# Altium schematic sheet Glucometer-InstrumentationCircuit-SMD.SchDoc
size A4; PageSetup: Record=PageOptions|CenterHorizontal=True|CenterVertical=True|PrintScale=1.00|XCorrection=1.00|YCorrection=1.00|PrintKind=1|BorderSize=5000000|LeftOffset=0|BottomOffset=0|Orientation=1|PaperLength=1000|PaperWidth=1000|Scale=100|PaperSource=7|PrintQuality=-4|MediaType=1|DitherType=10|PaperKind=A4|PrintScaleMode=1
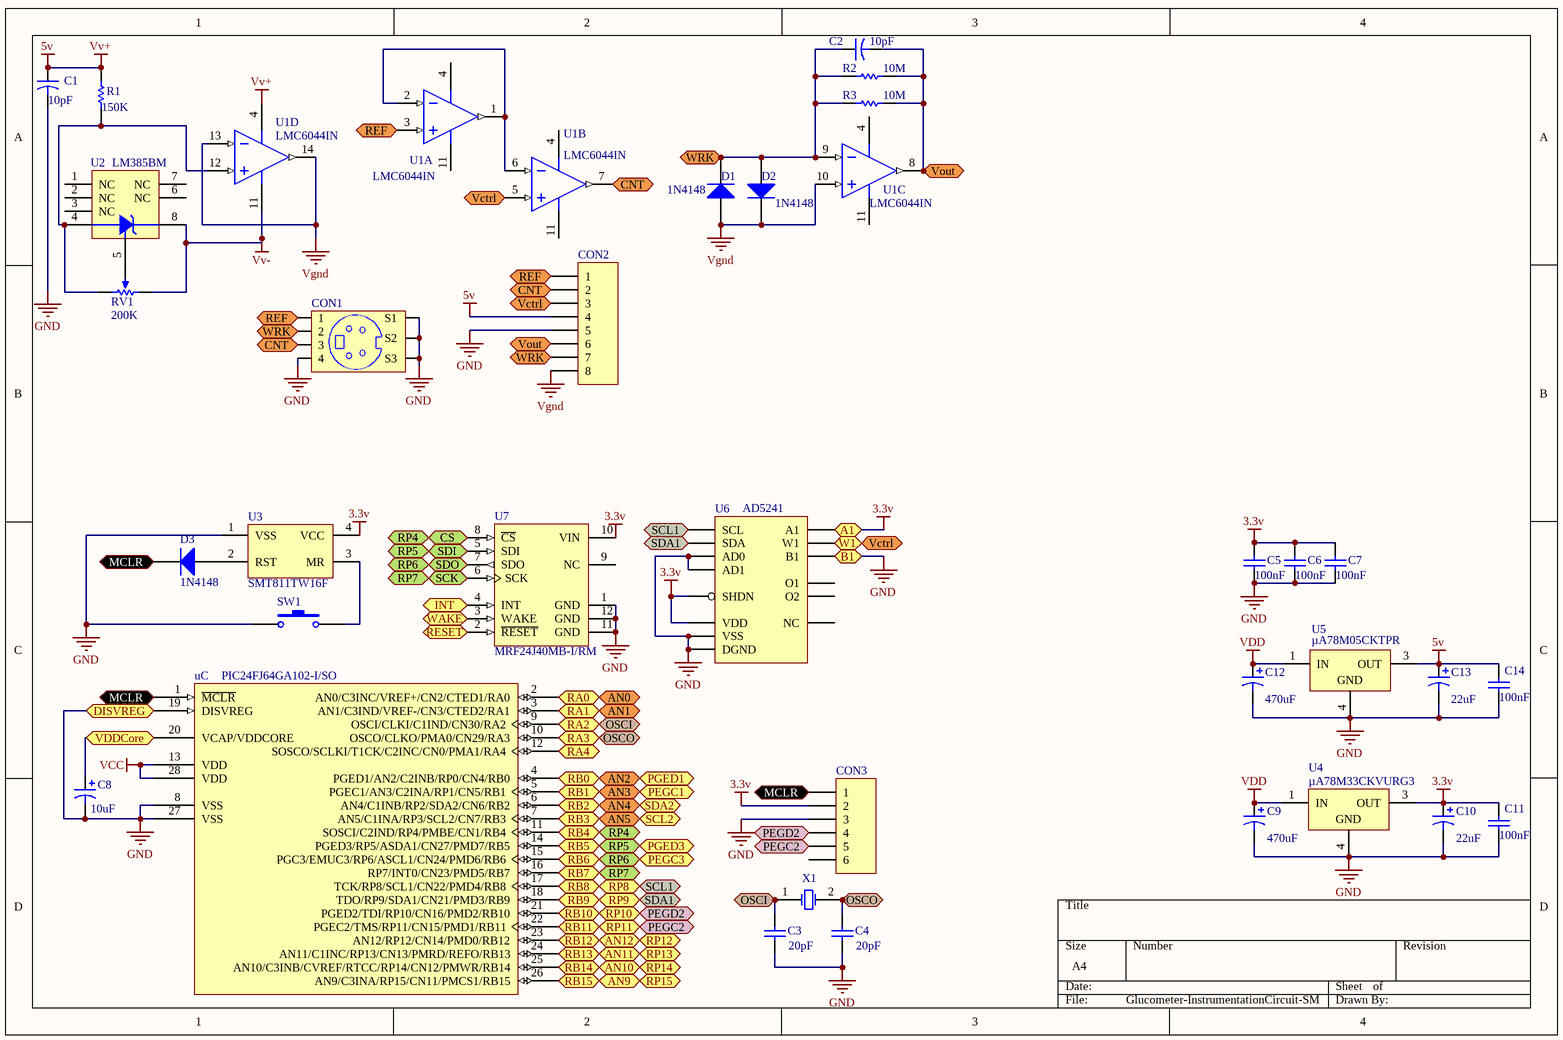
[diagram p0: Glucometer-InstrumentationCircuit-SMD.SchDoc]

## Parts
C1  value 10pF  [CAPC4532N]  (hidden comment: Cap2)
C2  value 10pF  [CAPC1005M]  (hidden comment: Cap2)
C3  value 20pF  [CAPR5-4X5]  (hidden comment: Cap)
C4  value 20pF  [CAPR5-4X5]  (hidden comment: Cap)
C5  value 100nF  [CAPC4532N]  (hidden comment: Cap)
C6  value 100nF  [CAPC4532N]  (hidden comment: Cap)
C7  value 100nF  [CAPC4532N]  (hidden comment: Cap)
C8  value 10uF  [C-4x4]  (hidden comment: Cap Pol1)
C9  value 470uF  [C-10x10]  (hidden comment: Cap Pol1)
C10  value 22uF  [C-4x4]  (hidden comment: Cap Pol1)
C11  value 100nF  [CAPC4532N]  (hidden comment: Cap)
C12  value 470uF  [C-10x10]  (hidden comment: Cap Pol1)
C13  value 22uF  [C-4x4]  (hidden comment: Cap Pol1)
C14  value 100nF  [CAPC4532N]  (hidden comment: Cap)
CON1  (no value)  [CDIN2.6-3H4A]
CON2  Header 8  [HDR1X8]  (value not drawn)
CON3  Header 6  [HDR1X6]  (value not drawn)
D1  1N4148  [DO-35]
D2  1N4148  [DO-35]
D3  1N4148  [DO-35]
R1  value 150K  [RESC5025N]  (hidden comment: Res1)
R2  value 10M  [RESC5025N]  (hidden comment: Res1)
R3  value 10M  [RESC5025N]  (hidden comment: Res1)
RV1  value 200K  [VR5]  (hidden comment: RPot)
SW1  SW-PB  [SPST-2]  (value not drawn)
U1  LMC6044IN  [M14A_N]  (parts A,B,C,D of 4)
U2  LM385BM  [M08A_N]
U3  SMT811TW16F  [SOT143]
U4  µA78M33CKVURG3  [KTP02]
U5  µA78M05CKTPR  [KTP02]
U6  AD5241  [R-14_N]
U7  MRF24J40MB-I/RM  [MRF24J40MB]
uC  PIC24FJ64GA102-I/SO  [SOIC-SO28_N]
X1  XTAL  [R38]  (value not drawn)

## Ports
A1, AN0, AN1, AN2, AN3, AN4, AN5, AN9, AN10, AN11, AN12, B1, CNT, CS, DISVREG, INT, MCLR, OSCI, OSCO, PEGC1, PEGC2, PEGC3, PEGD2, PGED1, PGED3, RA0, RA1, RA2, RA3, RA4, RB0, RB1, RB2, RB3, RB4, RB5, RB6, RB7, RB8, RB9, RB10, RB11, RB12, RB13, RB14, RB15, REF, RESET, RP4, RP5, RP6, RP7, RP8, RP9, RP10, RP11, RP12, RP13, RP14, RP15, SCK, SCL1, SCL2, SDA1, SDA2, SDI, SDO, Vctrl, VDDCore, Vout, W1, WAKE, WRK

## Nets
3.3v: C5.2 C6.2 C7.2 C10.1 C11.2 CON3.2 U3.4(VCC) U4.3(OUT) U6.1(A1) U6.4(VDD) U6.5(SHDN) U7.10(VIN) ; port A1
5v: C1.1 C13.1 C14.2 CON2.4 R1.2 U1.4(V+) U5.3(OUT)  [also labelled Vv+]
GND: C1.2 C3.1 C4.1 C5.1 C6.1 C7.1 C8.2 C9.2 C10.2 C11.1 C12.2 C13.2 C14.1 CON1.4 CON1.MH1(S1) CON1.MH2(S2) CON1.MH3(S3) CON2.5 CON3.3 SW1.1 U3.1(VSS) U4.4(GND) U5.4(GND) U6.3(B1) U6.8(AD0) U6.9(AD1) U6.10(DGND) U6.11(VSS) U7.1(GND) U7.11(GND) U7.12(GND) uC.8(VSS) uC.19(DISVREG) uC.27(VSS) ; port DISVREG, port B1
VCC: uC.13(VDD) uC.28(VDD)
VDD: C9.1 C12.1 U4.1(IN) U5.1(IN)
Vgnd: CON2.8 D1.1(A) D2.2(K) U1.10(IN3+) U1.13(IN4-) U1.14(OUT4)
Vv-: RV1.1(TOP) U1.11(V-) U2.8(+V)
AN0: uC.2(AN0/C3INC/VREF+/CN2/CTED1/RA0) ; port RA0, port AN0
AN1: uC.3(AN1/C3IND/VREF-/CN3/CTED2/RA1) ; port RA1, port AN1
AN2: uC.4(PGED1/AN2/C2INB/RP0/CN4/RB0) ; port RB0, port AN2, port PGED1
AN3: uC.5(PGEC1/AN3/C2INA/RP1/CN5/RB1) ; port RB1, port AN3, port PEGC1
AN4: uC.6(AN4/C1INB/RP2/SDA2/CN6/RB2) ; port RB2, port AN4, port SDA2
AN5: uC.7(AN5/C1INA/RP3/SCL2/CN7/RB3) ; port RB3, port AN5, port SCL2
AN9: uC.26(AN9/C3INA/RP15/CN11/PMCS1/RB15) ; port RB15, port AN9, port RP15
AN10: uC.25(AN10/C3INB/CVREF/RTCC/RP14/CN12/PMWR/RB14) ; port RB14, port AN10, port RP14
AN11: uC.24(AN11/C1INC/RP13/CN13/PMRD/REFO/RB13) ; port RB13, port AN11, port RP13
AN12: uC.23(AN12/RP12/CN14/PMD0/RB12) ; port RB12, port AN12, port RP12
CNT: CON1.3 CON2.2 U1.7(OUT2) ; port CNT
CS: U7.8(~{CS}) uC.11(SOSCI/C2IND/RP4/PMBE/CN1/RB4) ; port RB4, port RP4, port CS
INT: U7.4(INT) ; port INT
MCLR: CON3.1 D3.2(K) uC.1(~{MCLR}) ; port MCLR
OSCI: C3.2 uC.9(OSCI/CLKI/C1IND/CN30/RA2) X1.1(OSC1) ; port RA2, port OSCI
OSCO: C4.2 uC.10(OSCO/CLKO/PMA0/CN29/RA3) X1.2(OSC2) ; port RA3, port OSCO
PEGC2: CON3.5 uC.22(PGEC2/TMS/RP11/CN15/PMD1/RB11) ; port RB11, port RP11, port PEGC2
PEGC3: U7.7(SDO) uC.15(PGC3/EMUC3/RP6/ASCL1/CN24/PMD6/RB6) ; port RB6, port SDO, port RP6, port PEGC3
PEGD2: CON3.4 uC.21(PGED2/TDI/RP10/CN16/PMD2/RB10) ; port RB10, port RP10, port PEGD2
PGED3: U7.5(SDI) uC.14(PGED3/RP5/ASDA1/CN27/PMD7/RB5) ; port RB5, port SDI, port RP5, port PGED3
RA4: uC.12(SOSCO/SCLKI/T1CK/C2INC/CN0/PMA1/RA4) ; port RA4
RB7: U7.6(SCK) uC.16(RP7/INT0/CN23/PMD5/RB7) ; port RB7, port RP7, port SCK
RB8: U6.6(SCL) uC.17(TCK/RP8/SCL1/CN22/PMD4/RB8) ; port RB8, port SCL1, port RP8
RB9: U6.7(SDA) uC.18(TDO/RP9/SDA1/CN21/PMD3/RB9) ; port RB9, port SDA1, port RP9
REF: CON1.1 CON2.1 U1.3(IN1+) ; port REF
RESET: U7.2(~{RESET}) ; port RESET
Vctrl: CON2.3 U1.5(IN2+) U6.2(W1) ; port Vctrl, port W1
VDDCore: C8.1 uC.20(VCAP/VDDCORE) ; port VDDCore
Vout: C2.2 CON2.6 R2.1 R3.1 U1.8(OUT3) ; port Vout
WAKE: U7.3(WAKE) ; port WAKE
WRK: C2.1 CON1.2 CON2.7 D1.2(K) D2.1(A) R2.2 R3.2 U1.9(IN3-) ; port WRK
NetD3_1: D3.1(A) U3.2(RST)
NetR1_1: R1.1 RV1.2(BOT) U1.12(IN4+) U2.4(-V)
NetRV1_3: RV1.3(TAP) U2.5(FB)
NetSW1_2: SW1.2 U3.3(MR)
NetU1_1: U1.1(OUT1) U1.2(IN1-) U1.6(IN2-)

Not connected (* = marked no-connect by the designer): CON3 6; U2 1(NC) 2(NC) 3(NC) 6(NC) 7(NC); U6 12(O2) 13(NC) 14(O1); U7 9(NC)

## Library data of the parts
C1 C2 = Cap2: Capacitor; Published: 23-Sep-2002; PackageReference: CAPR5-4X5; Publisher: Altium Limited; PackageDescription: Capacitor; 2 Leads
C3-C7 C11 C14 = Cap: Capacitor; Published: 8-Jun-2000; LatestRevisionDate: 17-Jul-2002; LatestRevisionNote: Re-released for DXP Platform.; PackageReference: RAD-0.3; Publisher: Altium Limited; PackageDescription: Radial Cap, Thru-Hole; 2 Leads; 0.3 in Pin Spacing
C8-C10 C12 C13 = Cap Pol1: Polarized Capacitor (Radial); Published: 8-Jun-2000; LatestRevisionDate: 17-Jul-2002; LatestRevisionNote: Re-released for DXP Platform.; PackageReference: RB7.6-15; Publisher: Altium Limited; PackageDescription: Polarized Capacitor (Radial); 2 Leads
CON1 = MiniDin 4Pins - SuperVideo: MiniDin 4 Pins
CON2 = Header 8: Header, 8-Pin; LatestRevisionDate: 17-Jul-2002; LatestRevisionNote: Re-released for DXP Platform.; Publisher: Altium Limited
CON3 = Header 6: Header, 6-Pin; LatestRevisionDate: 17-Jul-2002; LatestRevisionNote: Re-released for DXP Platform.; Publisher: Altium Limited
D1-D3 = 1N4148: High Conductance Fast Diode; Published: 8-Jun-2000; LatestRevisionDate: 17-Jul-2002; LatestRevisionNote: Re-released for DXP Platform.; DatasheetDocument: 1997; PackageReference: DO-35; Publisher: Altium Limited; Code_JEDEC: DO-204-AH; ComponentLink1Description: Manufacturer Link; ComponentLink1URL: http://www.fairchildsemi.com/; ComponentLink2Description: Datasheet; ComponentLink2URL: http://www.fairchildsemi.com/ds/1N%2F1N4148.pdf
R1-R3 = Res1: Resistor; Published: 8-Jun-2000; LatestRevisionDate: 17-Jul-2002; LatestRevisionNote: Re-released for DXP Platform.; PackageReference: AXIAL-0.3; Publisher: Altium Limited; PackageDescription: Axial Device, Thru-Hole; 2 Leads; 0.3 in Pin Spacing
RV1 = RPot: Potentiometer; pin to pad: 2>3 3>2; Sim Note: Enter the Resistance value and the set point into parameter fields.; Set Position: 0.5; Published: 8-Jun-2000; LatestRevisionDate: 17-Jul-2002; LatestRevisionNote: Re-released for DXP Platform.; PackageReference: VR5; Publisher: Altium Limited; PackageDescription: Variable Resistor, Thru-Hole; 3 Leads
SW1 = SW-PB: Switch; Published: 24-Mar-1999; LatestRevisionDate: 17-Jul-2002; LatestRevisionNote: Re-released for DXP Platform.; PackageReference: SPST-2; Publisher: Altium Limited; PackageDescription: Switch; 2 Leads
U1 = LMC6044IN: CMOS Quad Micropower Operational Amplifier, 14-pin MDIP; Manufacturer: National Semiconductor; PackageTopMarking: NSUZXYYTTE#*LMC6044IN; PowerWise: Y; CompType: Amplifiers; Published: 4-Dec-2008; LatestRevisionDate: 13-Jan-2009; LatestRevisionNote: Sim Model Added.; DatasheetVersion: Aug-2000; PackageVersion: revG, May-2006; PackageReference: N14A; Publisher: Altium Limited; PackageDescription: MDIP, .750 x .250 x.130in, 14 Lead, .100in Pitch; Supplier 1: Farnell; Supplier Part Number 1: 9494634; PartNumber: LMC6044IN; RoHS: N; PinCount: 14; Code_JEDEC: MS-001-AA; ComponentLink1Description: LMC6044 Datasheet; ComponentLink1URL: http://www.national.com/ds/LM/LMC6044.pdf; ComponentLink2Description: LMC6044 Web Page; ComponentLink2URL: http://www.national.com/pf/LM/LMC6044.html; ComponentLink3Description: N14A Package Page; ComponentLink3URL: http://www.national.com/packaging/folders/n14a.html
U2 = LM385BM: Adjustable Micropower Voltage Reference, 8-pin Narrow SOIC; Manufacturer: National Semiconductor; PackageTopMarking: NSZXTT*LM385*BM; PowerWise: N; CompType: Voltage Reference IC; Published: 4-Dec-2008; DatasheetVersion: Jan-2008; PackageVersion: revM, May-2009; PackageReference: M08A; Publisher: Altium Limited; PackageDescription: SOIC Narrow, 4.9 x 3.9 x 1.45mm, 8 Lead, 1.27mm Pitch; Supplier 1: Farnell; Supplier Part Number 1: 953817; PartNumber: LM385BM; RoHS: N; PinCount: 8; Code_JEDEC: MS-012-AA; Code_IPC: SOIC127P600-8; ComponentLink1Description: LM385-ADJ Datasheet; ComponentLink1URL: http://www.national.com/ds/LM/LM385-ADJ.pdf; ComponentLink2Description: LM385-ADJ Web Page; ComponentLink2URL: http://www.national.com/pf/LM/LM385-ADJ.html; ComponentLink3Description: M08A Package Page; ComponentLink3URL: http://www.national.com/packaging/folders/m08a.html
U3 = SMT811TW16F: Reset Circuit, 3.08V, Push Pull Inverted RST
U4 = µA78M33CKVURG3: Positive-Voltage Regulator
U5 = µA78M05CKTPR: Positive-Voltage Regulator; Note: Pin 2 is electrically connected to pin4, and not drawn.; Published: 15-Apr-2002; DatasheetVersion: Jul-1999; PackageVersion: Jan-2001; PackageReference: KTP02; Publisher: Altium Limited; PackageDescription: PowerFLEX (D-PAK/TO-252-AA); 3 Leads (1 Cropped); Body 9.7 (inc. leads) x 6.2 mm (LxW max); Code_JEDEC: TO-252; ComponentLink1Description: Manufacturer Link; ComponentLink1URL: http://www.ti.com/; ComponentLink2Description: Datasheet; ComponentLink2URL: http://www-s.ti.com/sc/ds/ua78m05.pdf
U6 = AD5241: AD5241BR
U7 = MRF24J40MB-I/RM: 2.4 GHz IEEE Std. 802.15.4, 20 dBm RF Transceiver 12-Pin Module, Industrial Temperature; Published: 2-Dec-2009; DatasheetVersion: revB, Aug-2009; PackageVersion: Aug-2009; PackageReference: MRF24J40MB; Publisher: Altium Limited; PackageDescription: Transceiver Module; SM; 12 Leads; Body 1.3 x 0.9 x 0.1" (LxWxH), 0.1" Pitch; Supplier 1: Digi-Key; Supplier Part Number 1: MRF24J40MB-I/RM-ND; Supplier 2: Farnell; Supplier Part Number 2: 175519901; Supplier 3: Farnell; Supplier Part Number 3: 1755199; ComponentLink1Description: Datasheet; ComponentLink1URL: http://ww1.microchip.com/downloads/en/DeviceDoc/70599B.pdf; ComponentLink2Description: Packaging Specification; ComponentLink2URL: http://www.microchip.com/stellent/groups/techpub_sg/documents/packagingspec/en012702.pdf; ComponentLink3Description: Microchip.com Home; ComponentLink3URL: http://www.microchip.com/
uC = PIC24FJ64GA102-I/SO: General purpose 16-bit Flash Microcontroller with nanoWatt XLP, 64KB Flash, 8KB SRAM, 28-Pin SOIC, Industrial Temperature; Published: 2-Dec-2009; LatestRevisionDate: 07-Oct-2010; LatestRevisionNote: Updated to datasheet revision C, Aug-2010. Supplier links updated. Sch. pin 7 name corrected.; DatasheetVersion: revC, Aug-2010; PackageVersion: revBB, Aug-2009; PackageReference: SOIC-SO28; Publisher: Altium Limited; PackageDescription: 28-Lead Plastic Small Outline (SO) - Wide 7.50mm Body [SOIC]; Supplier 1: Digi-Key; Supplier Part Number 1: PIC24FJ64GA102-I/SO-ND; Supplier 2: Farnell; Supplier Part Number 2: 1778478; Code_JEDEC: MS-013; ComponentLink1Description: Datasheet; ComponentLink1URL: http://ww1.microchip.com/downloads/en/DeviceDoc/39951C.pdf; ComponentLink2Description: Packaging Specification; ComponentLink2URL: http://www.microchip.com/stellent/groups/techpub_sg/documents/packagingspec/en012702.pdf; ComponentLink3Description: Microchip.com Home; ComponentLink3URL: http://www.microchip.com/
X1 = XTAL: Crystal Oscillator; Published: 8-Jun-2000; LatestRevisionDate: 17-Jul-2002; LatestRevisionNote: Re-released for DXP Platform.; PackageReference: R38; Publisher: Altium Limited; PackageDescription: Crystal, Thru-Hole; 2 Leads; Body 3.1 x 8.2 mm (Dia.xH)